# EasyEDA Pro project USB Hub PCB Files V2.2.47.epro

# Board PCB1
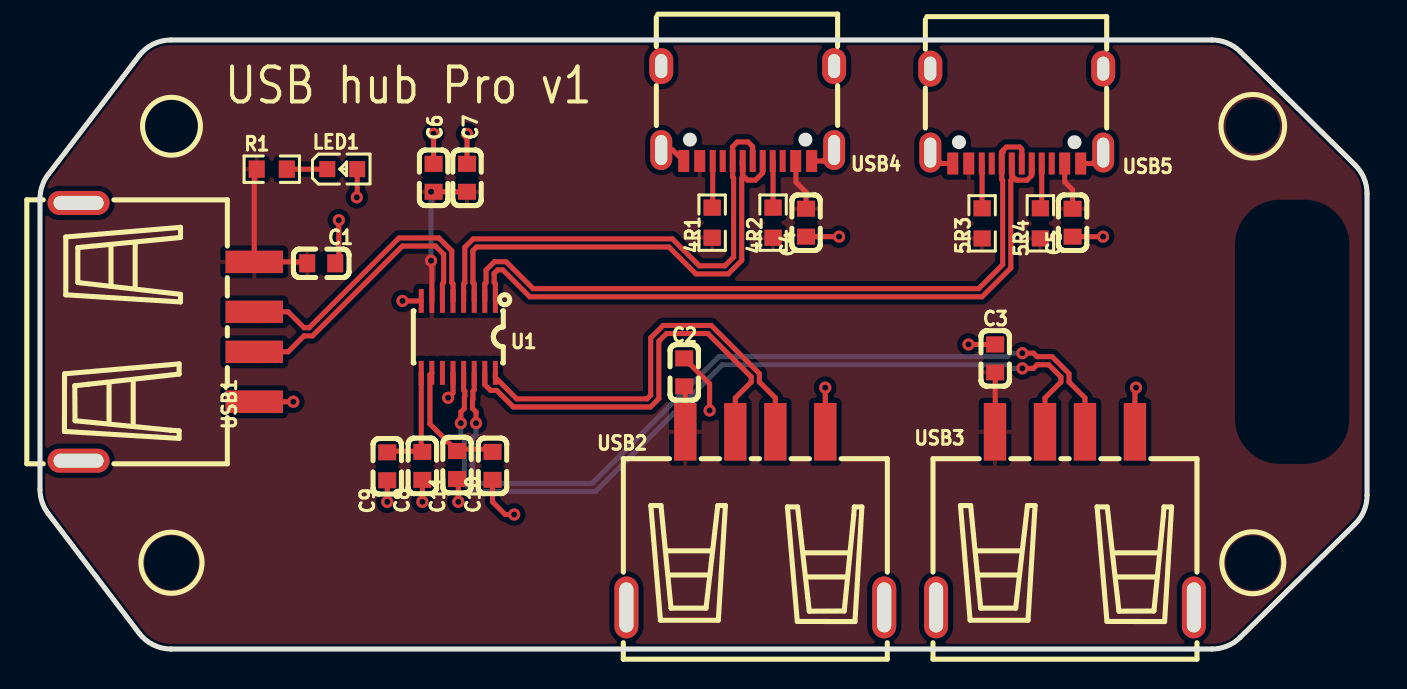
[diagram p0: board, top side]
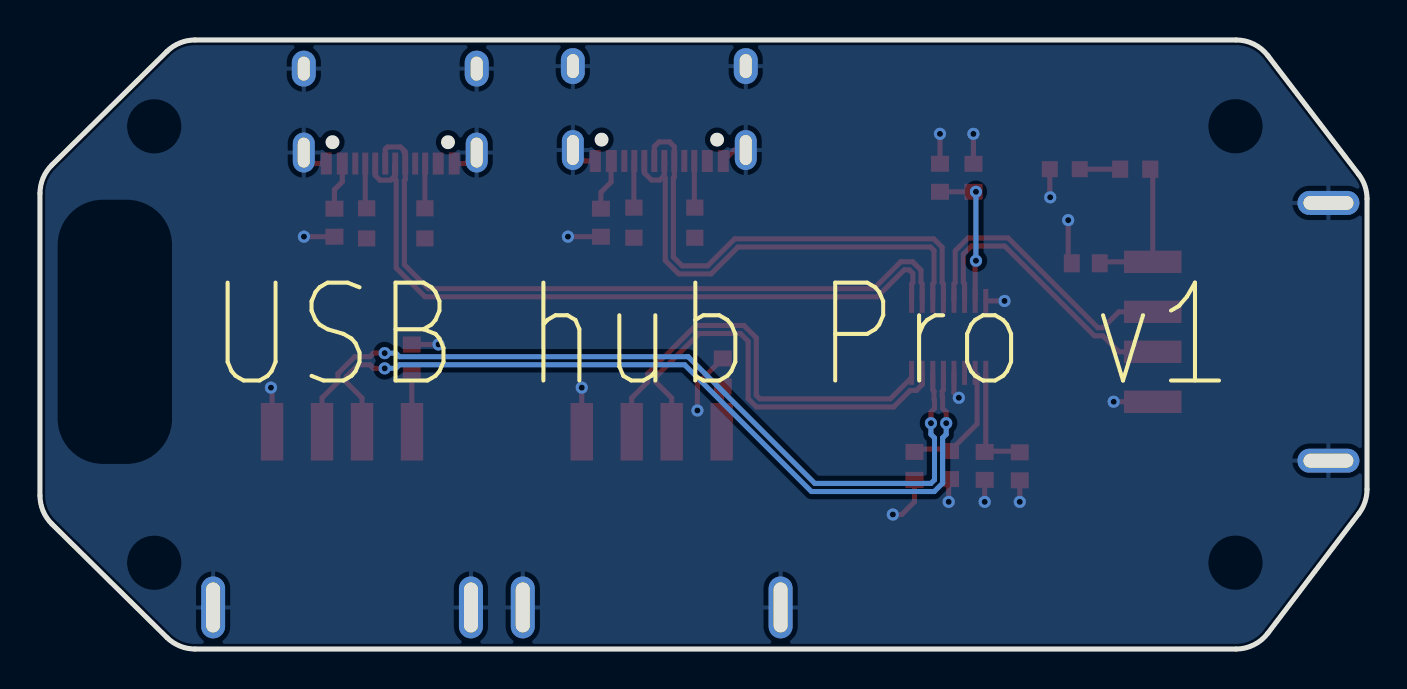
[diagram p1: board, bottom side, seen from below]

Outline 66.4 x 30.48 mm; copper layers: Top Layer, Bottom Layer. Coordinates in mm from the lower left corner of the outline.
Outline path: 0,22.53 arc(0.11,23.17) 0.41,23.75 4.96,29.7 arc(5.67,30.27) 6.55,30.48 58.64,30.48 arc(59.4,30.33) 60.04,29.9 65.8,24.22 arc(66.24,23.57) 66.4,22.8 66.4,7.68 arc(66.24,6.91) 65.8,6.26 60.04,0.58 arc(59.4,0.15) 58.64,0 6.56,0 arc(5.67,0.21) 4.96,0.79 0.41,6.78 arc(0.1,7.35) 0,7.99 0,22.53
Stack: Top Layer 0.035mm / Dielectric1 1.51mm FR4 er 4.5 / Bottom Layer 0.035mm

## Design rules (mm)
net DN2: DP5
net DP2: DP5
net DN1: DP4
net DP1: DP4
net DN: DP1
net DP: DP1
net DN4: DP3
net DP4: DP3
net DN3: DP2
net DP3: DP2
template: Custom Config
spacing copperThickness1oz (default): track to track 0.102, other pairs 0.152 to 0.3
spacing copperThickness2oz: track to track 0.203, other pairs 0.152 to 0.3
track width copperThickness1oz (default): min 0.127, default 0.254, max 2.54
track width copperThickness2oz: min 0.203, default 0.254, max 2.54
differential pair differentialPair (default): width min 0.127, default 0.254, max 2.54; gap min 0.152, default 0.152
via viaSize (default): diameter min 0.5, default 0.61, max 10; hole min 0.3, default 0.305, max 6.3

## Placement (name value [footprint] x y rotation side)
4R1  5.1K  [R0603]  33.63 21.34 270 top
4R2  5.1K  [R0603]  36.68 21.34 270 top
5R3  5.1K  [R0603]  47.14 21.3 270 top
5R4  5.1K  [R0603]  50.05 21.3 270 top
C1  1uF  [C0603]  14.07 19.3 0 top
C2  1uF  [C0603]  32.23 13.84 270 top
C3  1uF  [C0603]  47.79 14.54 270 top
C4  1uF  [C0603]  38.33 21.34 270 top
C5  1uF  [C0603]  51.66 21.34 270 top
C6  100nF  [C0603]  19.69 23.58 90 top
C7  1uF  [C0603]  21.37 23.58 90 top
C8  1uF  [C0603]  19.13 9.17 270 top
C9  100nF  [C0603]  17.37 9.14 270 top
C10  1uF  [C0603]  22.64 9.17 270 top
C11  100nF  [C0603]  20.87 9.21 270 top
LED1  KT-0603R  [LED0603-RD]  15.12 24.01 0 top
R1  330  [R0603]  11.6 24.01 0 top
U1  SL2.1s  [SSOP-16_L4.6-W2.6-P0.53-LS4.0-BL]  20.93 15.62 180 top
USB1  10.0 QHHTZB6.3  [USB-A-TH_10.0QHHTZB6.3]  6.33 15.88 270 top
USB2  10.0 QHHTZB6.3  [USB-A-TH_10.0QHHTZB6.3]  35.79 6.48 0 top
USB3  10.0 QHHTZB6.3  [USB-A-TH_10.0QHHTZB6.3]  51.28 6.48 0 top
USB4  TYPE-C 16PIN 2MD(073)  [USB-C-SMD_TYPE-C-6PIN-2MD-073]  35.41 26.8 180 top
USB5  TYPE-C 16PIN 2MD(073)  [USB-C-SMD_TYPE-C-6PIN-2MD-073]  48.87 26.67 180 top

## Footprints (pads in the part's own frame, mm; a bottom-side part is the same pattern mirrored in y, then rotated)
C0603
  rect 0.8x0.9 smd: 1(-0.7,0) 2(0.7,0)
LED0603-RD
  rect 0.8x0.8 smd: 1(-0.749,0) 2(0.749,0)
R0603
  rect 0.806x0.864 smd: 1(-0.753,0) 2(0.753,0)
SSOP-16_L4.6-W2.6-P0.53-LS4.0-BL
  rect 0.25x1.2 smd: 1(-1.855,-1.8) 2(-1.325,-1.8) 3(-0.795,-1.8) 4(-0.265,-1.8) 5(0.265,-1.8) 6(0.795,-1.8) 7(1.325,-1.8) 8(1.855,-1.8) 9(1.855,1.8) 10(1.325,1.8) 11(0.795,1.8) 12(0.265,1.8) 13(-0.265,1.8) 14(-0.795,1.8) 15(-1.325,1.8) 16(-1.855,1.8)
USB-A-TH_10.0QHHTZB6.3
  rect 1.12x2.88 smd: 1(-3.5,4.395) 2(-1,4.395) 3(1,4.395) 4(3.5,4.395)
  oval 1.2x3.1 hole 0.7x2.5: 5(-6.45,-4.395) 6(6.45,-4.395)
USB-C-SMD_TYPE-C-6PIN-2MD-073
  rect 0.55x1.1 smd: 1(-3.2,2.375) 2(-2.4,2.375) 11(2.4,2.375) 12(3.2,2.375)
  rect 0.3x1.1 smd: 3(-1.75,2.375) 4(-1.25,2.375) 5(-0.75,2.375) 6(-0.25,2.375) 7(0.25,2.375) 8(0.75,2.375) 9(1.25,2.375) 10(1.75,2.375)
  oval 1.1x2 hole 0.6x1.5: 13(-4.325,1.825) 14(4.325,1.825)
  oval 1.2x1.8 hole 0.6x1.2: 13(-4.325,-2.375) 14(4.325,-2.375)

## Nets
+5V: 4R1.2 4R2.2 5R3.2 5R4.2 C1.1 C2.2 C3.2 C4.1 C5.1 C6.1 C7.1 R1.1 U1.7 USB1.1 USB2.1 USB3.1 USB4.2 USB4.11 USB5.2 USB5.11
GND: C1.2 C2.1 C3.1 C4.2 C5.2 C6.2 C7.2 C8.2 C9.2 C10.2 C11.2 LED1.2 U1.8 U1.12 USB1.4 USB1.5 USB1.6 USB2.4 USB2.5 USB2.6 USB3.4 USB3.5 USB3.6 USB4.1 USB4.12 USB4.13 USB4.14 USB5.1 USB5.12 USB5.13 USB5.14
DN: U1.5 USB1.2
DN1: U1.3 USB4.5 USB4.7
DN2: U1.1 USB5.5 USB5.7
DN3: U1.15 USB2.2
DN4: U1.13 USB3.2
DP: U1.6 USB1.3
DP1: U1.4 USB4.6 USB4.8
DP2: U1.2 USB5.6 USB5.8
DP3: U1.16 USB2.3
DP4: U1.14 USB3.3
$1N1433: 4R1.1 USB4.10
$1N1438: 4R2.1 USB4.4
$1N2535: 5R4.1 USB5.4
$1N2538: 5R3.1 USB5.10
$1N2818: C10.1 C11.1 U1.10
$1N2824: C8.1 C9.1 U1.9
$1N6477: LED1.1 R1.2

Pads without a net: U1 11; USB4 3 9; USB5 3 9

## Via types
v1: diameter 0.61, hole 0.305, Top Layer to Bottom Layer, 23 vias

## Routing (per net, layer and track width the routed paths; a pad name or vN(x,y) marks a point on that pad's centre or on a via; arc(x,y) is an arc through that point)
+5V: length 24.7
  Top Layer w0.254: v1(19.57,22.88) 21.24,22.88 ; C2.2 32.29,13.09 USB2.1 ; C4.1 38.33,22.86 37.82,23.37 37.82,24.41 USB4.2 ; C5.1 51.66,22.99 51.27,23.38 USB5.2 ; U1.7 19.61,19.39 v1(19.57,19.43) ; C3.2 47.79,10.88 USB3.1 ; 13.25,19.3 13.17,19.38 USB1.1 10.72,23.89 10.84,24.01
  Bottom Layer w0.254: v1(19.57,22.88) v1(19.57,19.43)
GND: length 34.2
  Top Layer w0.254: USB4.13 39.18,24.42 USB4.1 ; USB5.1 52.65,24.3 USB5.13 ; v1(23.72,6.73) 23.28,6.73 22.64,7.37 C10.2 ; C6.2 v1(19.69,25.78) ; C7.2 v1(21.37,25.78) ; USB5.14 45.1,24.3 USB5.12 ; v1(14.95,21.46) 14.95,19.48 C1.2 ; USB1.4 v1(12.68,12.38) ; U1.12 20.67,12.82 v1(20.42,12.57) ; v1(20.93,7.37) 20.93,8.44 C11.2 ; v1(33.5,11.94) 33.5,13.27 C2.1 ; U1.8 v1(18.14,17.42) ; LED1.2 15.87,22.63 v1(15.85,22.61) ; C8.2 v1(19.13,7.37) ; C4.2 v1(39.98,20.64) ; 31.08,24.97 31.66,24.97 USB4.12 ; C5.2 v1(53.19,20.64) ; v1(54.84,13.08) 54.78,13.03 USB3.4 ; USB2.4 v1(39.29,13.08) ; C9.2 v1(17.37,7.37) ; C3.1 v1(46.46,15.24)
DN: length 14.9
  Top Layer w0.254: U1.5 20.67,18.28 20.6,18.34 20.6,19.93 19.96,20.57 17.96,20.57 13.47,16.08 13.21,16.08 12.41,16.88 USB1.2
DN1: length 24.5
  Top Layer w0.254: 35.16,23.7 35.16,23.62 35.11,23.57 35.11,19.45 34.43,18.77 32.82,18.77 31.47,20.12 21.84,20.12 21.66,19.94 21.66,18.34 21.73,18.28 U1.3 ; 35.16,23.7 35.16,23.7 35.16,24.22 35.14,24.24 35.14,24.4 USB4.7 35.16,23.7 ; 35.16,23.7 35.39,23.47 35.8,23.47 36.16,23.83 USB4.5
DN2: length 36.1
  Top Layer w0.254: USB5.5 49.62,23.7 49.39,23.47 48.86,23.47 48.64,23.68 48.64,24.27 USB5.7 48.62,23.49 48.57,23.44 48.57,19.07 47.13,17.63 24.51,17.63 23.16,18.98 22.9,18.98 22.72,18.8 22.72,18.34 22.79,18.28 U1.1
DN3: length 21.6
  Top Layer w0.254: USB2.2 34.79,12.57 35.59,13.36 35.59,13.62 33.42,15.79 31.34,15.79 30.96,15.41 30.96,12.53 30.55,12.11 23.68,12.11 22.86,12.94 22.55,12.94 22.26,13.23 U1.15
DN4: length 41.8
  Top Layer w0.254: v1(49.15,14.05) 49.71,14.05 49.89,14.22 50.47,14.22 51.08,13.62 51.08,13.36 50.28,12.57 USB3.2 ; v1(21.06,11.3) 21.06,11.86 21.23,12.04 21.23,12.63 21.26,12.65 21.26,12.91 21.2,12.97 U1.13
  Bottom Layer w0.254: v1(21.06,11.3) 21.06,10.74 21.23,10.57 21.23,8.3 21.65,7.88 27.8,7.88 34.14,14.22 48.41,14.22 48.59,14.05 v1(49.15,14.05)
DP: length 14.2
  Top Layer w0.254: USB1.3 12.41,14.88 13.21,15.67 13.63,15.67 18.13,20.17 19.79,20.17 20.2,19.76 20.2,18.34 20.14,18.28 20.14,17.42
DP1: length 24.5
  Top Layer w0.254: USB4.6 35.66,25.14 35.42,25.38 34.89,25.38 34.66,25.14 USB4.8 34.66,23.62 34.71,23.57 34.71,19.62 34.27,19.18 32.99,19.18 31.64,20.53 21.67,20.53 21.26,20.11 21.26,18.34 21.2,18.28 U1.4
DP2: length 36.2
  Top Layer w0.254: U1.2 22.26,18.28 22.32,18.34 22.32,18.96 22.73,19.38 23.33,19.38 24.67,18.03 46.97,18.03 48.17,19.24 48.17,23.44 48.12,23.49 USB5.8 48.12,24.89 48.19,24.89 48.19,24.96 48.36,25.12 49.01,25.12 49.12,25.02 USB5.6
DP3: length 21.3
  Top Layer w0.254: USB2.3 36.79,12.57 35.99,13.36 35.99,13.79 33.58,16.19 31.18,16.19 30.56,15.57 30.56,12.7 30.38,12.52 23.85,12.52 22.79,13.59 U1.16
DP4: length 41.8
  Top Layer w0.254: U1.14 21.73,12.97 21.66,12.91 21.66,12.48 21.64,12.46 21.64,12.04 21.82,11.86 v1(21.82,11.3) ; USB3.3 52.28,12.57 51.49,13.36 51.49,13.79 50.64,14.63 49.89,14.63 49.71,14.81 v1(49.15,14.81)
  Bottom Layer w0.254: v1(49.15,14.81) 48.59,14.81 48.41,14.63 33.97,14.63 27.63,8.29 21.82,8.29 21.64,8.47 21.64,10.57 21.82,10.74 v1(21.82,11.3)
$1N1433: length 2.3
  Top Layer w0.254: USB4.10 33.66,22.12 4R1.1
$1N1438: length 2.3
  Top Layer w0.254: 4R2.1 36.68,24.4 USB4.4
$1N2535: length 2.3
  Top Layer w0.254: 5R4.1 50.12,22.12 USB5.4
$1N2538: length 2.2
  Top Layer w0.254: 5R3.1 47.14,24.28 USB5.10
$1N2818: length 6.3
  Top Layer w0.254: U1.10 19.51,13.72 19.51,11.26 20.77,10 22.5,10 C10.1
$1N2824: length 5.6
  Top Layer w0.254: U1.9 19.08,9.9 17.43,9.9 C9.1
$1N6477: length 2
  Top Layer w0.254: R1.2 LED1.1

## Copper pours and planes (outline as drawn; the poured copper is in the pictures)
+5V on Top Layer: -0.17,30.75 66.64,30.75 66.64,-0.24 -0.17,-0.24
GND on Bottom Layer: -0.02,30.73 66.65,30.73 66.65,-0.25 -0.02,-0.25

## Text on the board
Bottom Silkscreen Layer: USB hub Pro v1
Top Silkscreen Layer: USB hub Pro v1
